# Altium schematic sheet MCU.SchDoc: Microcontroller
size A4; Engineer: CT; SheetNumber: 2; SheetTotal: 5; SPICEModelCacheWAOLYTKC: <root> / <DocumentId>WAOLYTKC</DocumentId> / </root>
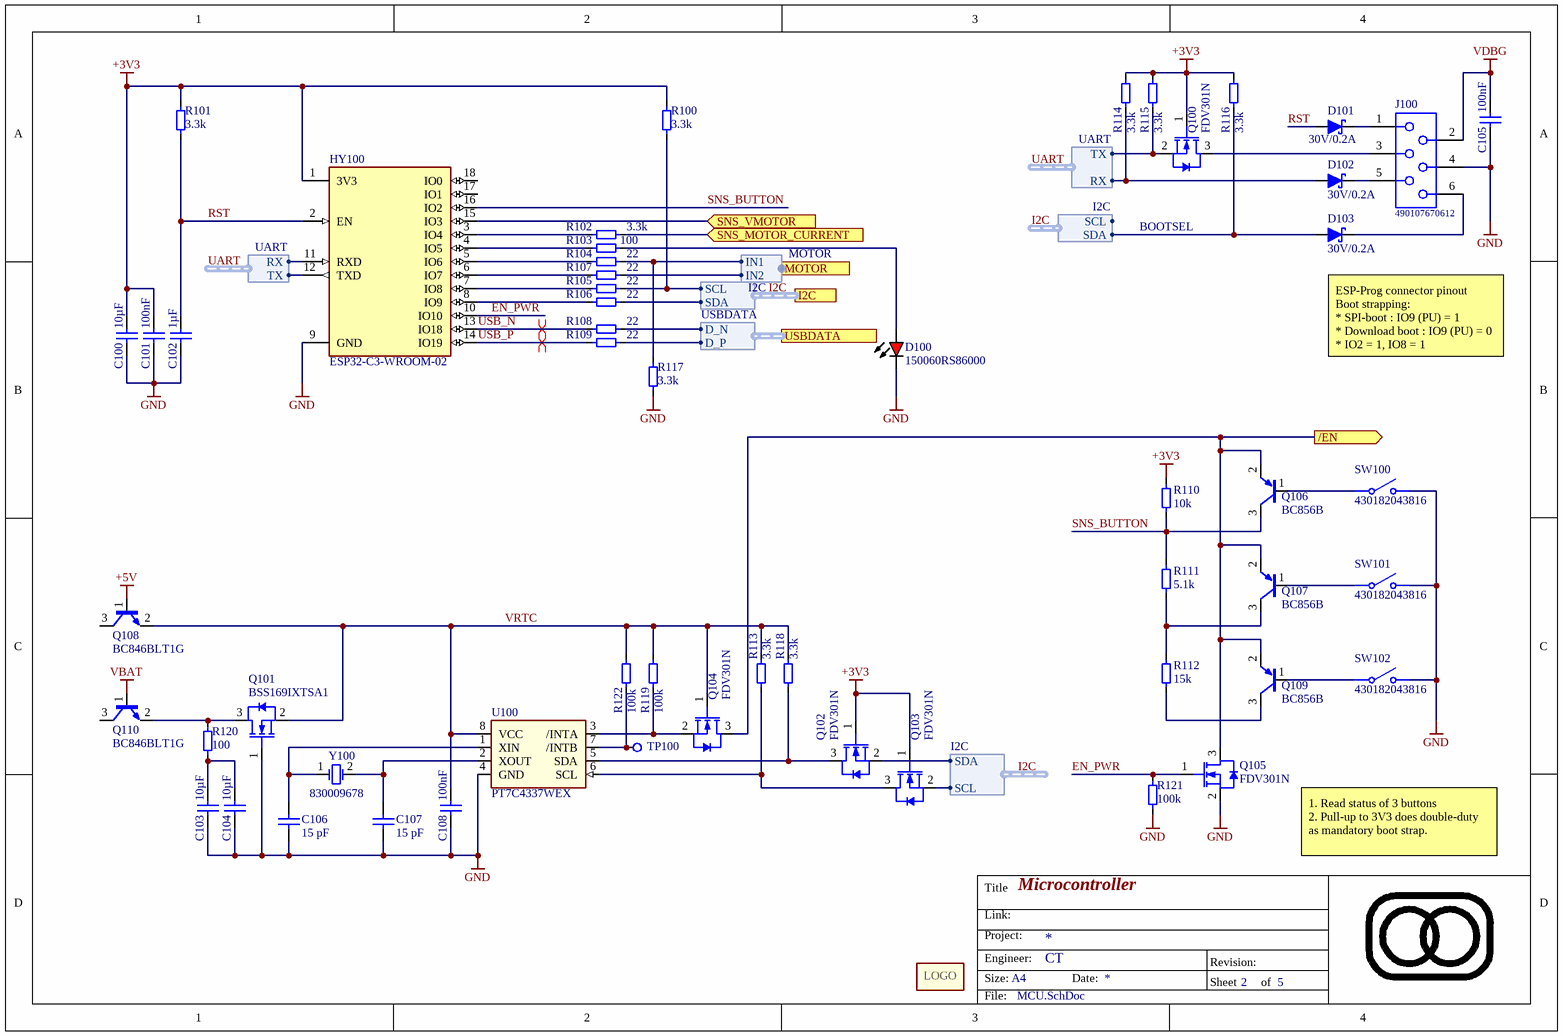
[diagram p0: MCU.SchDoc]

## Parts
C100  value 10µF  [0805-C-L]  (hidden comment: Capacitor 10µF +/-10% 10V X7R 0805)
C101  value 100nF  [0603-C-L]  (hidden comment: Capacitor 100nF +/-10% 25V X7R 0603)
C102  value 1µF  [0603-C-N]  (hidden comment: Capacitor 1µF +/-10% 16V X7R 0603)
C103  value 10µF  [0805-C-L]  (hidden comment: Capacitor 10µF +/-10% 10V X7R 0805)
C104  value 10µF  [0805-C-L]  (hidden comment: Capacitor 10µF +/-10% 10V X7R 0805)
C105  value 100nF  [0603-C-L]  (hidden comment: Capacitor 100nF +/-10% 25V X7R 0603)
C106  value 15 pF  [0603-C-N]  (hidden comment: Capacitor 15 pF +/-5% 50V C0G 0603)
C107  value 15 pF  [0603-C-N]  (hidden comment: Capacitor 15 pF +/-5% 50V C0G 0603)
C108  value 100nF  [0603-C-L]  (hidden comment: Capacitor 100nF +/-10% 25V X7R 0603)
D100  150060RS86000  [WL-SMCW_0603_150060xx8x000]
D101  value 30V/0.2A  [SOD-123-N]  (hidden comment: BAT54T1G)
D102  value 30V/0.2A  [SOD-123-N]  (hidden comment: BAT54T1G)
D103  value 30V/0.2A  [SOD-123-N]  (hidden comment: BAT54T1G)
HY100  ESP32-C3-WROOM-02  [ESP32­C3­WROOM­02]
J100  490107670612  [490107670612_Debugging Application]  (no BOM)
M100  Logo  [LOGO_9x6mm]  (value not drawn)  (no BOM)
Q100  FDV301N  [SOT-23-3-N]
Q101  BSS169IXTSA1  [SOT-23-3-N]
Q102  FDV301N  [SOT-23-3-N]
Q103  FDV301N  [SOT-23-3-N]
Q104  FDV301N  [SOT-23-3-N]
Q105  FDV301N  [SOT-23-3-N]
Q106  BC856B  [SOT-23-3-N]
Q107  BC856B  [SOT-23-3-N]
Q108  BC846BLT1G  [SOT-23-3-N]
Q109  BC856B  [SOT-23-3-N]
Q110  BC846BLT1G  [SOT-23-3-N]
R100  value 3.3k  [0603-R-N]  (hidden comment: Resistor 3.3k +/-1% 50V 0603)
R101  value 3.3k  [0603-R-N]  (hidden comment: Resistor 3.3k +/-1% 50V 0603)
R102  value 3.3k  [0603-R-N]  (hidden comment: Resistor 3.3k +/-1% 50V 0603)
R103  value 100  [0603-R-N]  (hidden comment: Resistor 100R +/-1% 50V 0603)
R104  value 22  [0603-R-N]  (hidden comment: Resistor 22R +/-1% 50V 0603)
R105  value 22  [0603-R-N]  (hidden comment: Resistor 22R +/-1% 50V 0603)
R106  value 22  [0603-R-N]  (hidden comment: Resistor 22R +/-1% 50V 0603)
R107  value 22  [0603-R-N]  (hidden comment: Resistor 22R +/-1% 50V 0603)
R108  value 22  [0603-R-N]  (hidden comment: Resistor 22R +/-1% 50V 0603)
R109  value 22  [0603-R-N]  (hidden comment: Resistor 22R +/-1% 50V 0603)
R110  value 10k  [0603-R-N]  (hidden comment: Resistor 10k +/-1% 50V 0603)
R111  value 5.1k  [0603-R-N]  (hidden comment: Resistor 5.1k +/-1% 50V 0603)
R112  value 15k  [0603-R-N]  (hidden comment: Resistor 15k +/-1% 50V 0603)
R113  value 3.3k  [0603-R-N]  (hidden comment: Resistor 3.3k +/-1% 50V 0603)
R114  value 3.3k  [0603-R-N]  (hidden comment: Resistor 3.3k +/-1% 50V 0603)
R115  value 3.3k  [0603-R-N]  (hidden comment: Resistor 3.3k +/-1% 50V 0603)
R116  value 3.3k  [0603-R-N]  (hidden comment: Resistor 3.3k +/-1% 50V 0603)
R117  value 3.3k  [0603-R-N]  (hidden comment: Resistor 3.3k +/-1% 50V 0603)
R118  value 3.3k  [0603-R-N]  (hidden comment: Resistor 3.3k +/-1% 50V 0603)
R119  value 100k  [0603-R-N]  (hidden comment: Resistor 100k +/-1% 50V 0603)
R120  value 100  [0603-R-N]  (hidden comment: Resistor 100R +/-1% 50V 0603)
R121  value 100k  [0603-R-N]  (hidden comment: Resistor 100k +/-1% 50V 0603)
R122  value 100k  [0603-R-N]  (hidden comment: Resistor 100k +/-1% 50V 0603)
SW100  430182043816  [WS-TASV_L6W6H4.3_4301x20438x6]
SW101  430182043816  [WS-TASV_L6W6H4.3_4301x20438x6]
SW102  430182043816  [WS-TASV_L6W6H4.3_4301x20438x6]
TP100  Testpad with multiple sizes  [TP_1.5mm]  (value not drawn)  (no BOM)
U100  PT7C4337WEX  [SOIC8_N]
Y100  830009678  [WE-XTAL_CFPX-217]

## Ports
/EN (out), I2C (harness I2C), MOTOR (harness MOTOR), SNS_MOTOR_CURRENT (in), SNS_VMOTOR (in), USBDATA (harness USBDATA)

## Harnesses
USBDATA: D_N, D_P
UART: RX, TX
I2C: SDA, SCL
MOTOR: IN1, IN2

## Nets
+3V3: C100.2 C101.2 HY100.1(3V3) Q100.1(G) Q102.1(G) Q103.1(G) R100.2 R101.2 R110.2 R114.2 R115.2 R116.2
+5V: Q108.1(B)
GND: C100.1 C101.1 C102.1 C103.1 C104.1 C105.1 C106.1 C107.1 C108.1 D100.1(K) HY100.9(GND) J100.4 Q101.1(G) Q105.2(S) R117.1 R121.2 SW100.2 SW101.2 SW102.2 U100.4(GND)
VBAT: Q110.1(B)
VDBG: C105.2 J100.2
/EN: Q104.3(D) Q105.3(D) Q106.2(E) Q107.2(E) Q109.2(E) ; port /EN
EN_PWR: HY100.10(IO10) Q105.1(G) R121.1
I2C.SCL: Q103.2(S) R100.1 R105.2 ; port I2C.SCL
I2C.SDA: D103.2(A) Q102.2(S) R106.2 R116.1 ; port I2C.SDA
RST: C102.2 D101.2(A) HY100.2(EN) R101.1
SNS_BUTTON: HY100.16(IO2) Q106.3(C) R110.1 R111.2
SNS_MOTOR_CURRENT: R102.2 ; port SNS_MOTOR_CURRENT
SNS_VMOTOR: HY100.15(IO3) ; port SNS_VMOTOR
UART.RX: D102.2(A) HY100.11(RXD) R114.1 ; harness UART.RX
UART.TX: HY100.12(TXD) Q100.2(S) R115.1 ; harness UART.TX
USB_N: HY100.13(IO18) R108.1
USB_P: HY100.14(IO19) R109.1
VRTC: C108.2 Q101.2(S) Q104.1(G) Q108.2(E) R113.2 R118.2 R119.1 R122.1 U100.8(VCC)
NetC103_2: C103.2 C104.2 R120.2
NetC106_2: C106.2 U100.1(XIN) Y100.1(OSC1)
NetC107_2: C107.2 U100.2(XOUT) Y100.2(OSC2)
NetD100_2: D100.2(A) R103.2
NetD101_1: D101.1(C) J100.1
NetD102_1: D102.1(C) J100.5
NetD103_1: D103.1(C) J100.6
NetHY100_3: HY100.3(IO4) R102.1
NetHY100_4: HY100.4(IO5) R103.1
NetHY100_5: HY100.5(IO6) R104.1
NetHY100_6: HY100.6(IO7) R107.1
NetHY100_7: HY100.7(IO8) R105.1
NetHY100_8: HY100.8(IO9) R106.1
NetJ100_3: J100.3 Q100.3(D)
NetQ101_3: Q101.3(D) Q110.2(E) R120.1
NetQ102_3: Q102.3(D) R118.1 U100.5(SDA)
NetQ103_3: Q103.3(D) R113.1 U100.6(SCL)
NetQ104_2: Q104.2(S) R119.2 U100.3(/INTA)
NetQ106_1: Q106.1(B) SW100.1
NetQ107_1: Q107.1(B) SW101.1
NetQ107_3: Q107.3(C) R111.1 R112.2
NetQ109_1: Q109.1(B) SW102.1
NetQ109_3: Q109.3(C) R112.1
NetR104_2: R104.2 R117.2 ; port MOTOR.IN1
NetR107_2: R107.2 ; port MOTOR.IN2
NetR108_2: R108.2 ; port USBDATA.D_N
NetR109_2: R109.2 ; port USBDATA.D_P
NetR122_2: R122.2 TP100.1(Pad) U100.7(/INTB)

Not connected (* = marked no-connect by the designer): HY100 17(IO1) 18(IO0); Q108 3(C); Q110 3(C)

## Buses and harness runs
harness I2C = port I2C

## Layout directives
differential pair: USB_N, USB_P

## Notes on the sheet
- BOOTSEL
- (near D103) ESP-Prog connector pinout
  Boot strapping:
  * SPI-boot : IO9 (PU) = 1
  * Download boot : IO9 (PU) = 0
  * IO2 = 1, IO8 = 1
- 1. Read status of 3 buttons
  2. Pull-up to 3V3 does double-duty as mandatory boot strap.
- Title
- Link:
- Size:
- Project:
- Engineer:
- A4
- Date:
- Revision:
- Sheet
- of
- File:
- (in symbol Logo) LOGO

## Library data of the parts
C100 C103 C104 = CMP-072-000663-10: WCAP-CSGP Multilayer Ceramic Chip Capacitor, General Purpose, size 0805, X7R, 10µF, 10VDC; Technical Reference: X7R0805106K010DFCT10000; Tolerance: 10%; Capacitor Type: MLCC; Insulation Resistance: 0.01GO; Length: 2mm; ComponentLink2URL: https://www.we-online.com/redexpert/spec/885012207026?ad; Packaging: Tape and Reel; ComponentLink1Description: Website Link; Design Item ID: 885012207026; Source: WCAP-CSGP.SchLib; ComponentLink2Description: Datasheet Link; Pins: 2; Usage: General Purpose; Voltage Rating: 10V; Height: 1.25mm; ComponentLink1URL: https://www.we-online.com/redexpert/article/885012207026?ad; Dielectric: X7R; Mounting Technology: SMT; Dissipation Factor: 10%; Min Operating Temperature: -55°C; Width: 1.25mm; Max Operating Temperature: 125°C; Case/Package: 0805; Match Code: WCAP-CSGP; JLCPCB Part #: C15850
C101 C105 C108 = CMP-072-000593-10: WCAP-CSGP Multilayer Ceramic Chip Capacitor, General Purpose, size 0603, X7R, 100nF, 25VDC; Capacitor Type: MLCC; Tolerance: 10%; Dissipation Factor: 3.5%; Technical Reference: X7R0603104K025DFCT20000; Insulation Resistance: 5GO; Length: 1.6mm; Dielectric: X7R; Height: 0.8mm; Pins: 2; Min Operating Temperature: -55°C; Usage: General Purpose; Mounting Technology: SMT; Case/Package: 0603; Width: 0.8mm; Max Operating Temperature: 125°C; Voltage Rating: 25V; Design Item ID: 885012206071R; ComponentLink1URL: https://www.we-online.com/redexpert/article/885012206071R?ad; ComponentLink2URL: https://www.we-online.com/redexpert/spec/885012206071R?ad; Packaging: Tape and Reel; ComponentLink1Description: Website Link; Match Code: WCAP-CSGP; ComponentLink2Description: Datasheet Link; Source: WCAP-CSGP.SchLib
C102 = CMP-001-00004-18: Capacitor MLCC, General Purpose, size 0603, X7R, 1µF, +/-10%, 16V; Tolerance: 10%; Usage: General Purpose; Mounting Technology: SMT; Width: 0.8mm; Voltage Rating: 16V; RoHS Compliant: True; Capacitor Type: MLCC; Case/Package: 0603; Min Operating Temperature: -55°C; Dielectric: X7R; Pins: 2; Max Operating Temperature: 125°C; Length: 1.6mm; Height: 0.8mm; JLCPCB Part #: C15849
C106 C107 = CMP-001-00107-9: Capacitor MLCC, General Purpose, size 0603, C0G, 15 pF, +/-5%, 50V; Tolerance: 5%; Min Operating Temperature: -55°C; RoHS Compliant: Yes; Dielectric: C0G; Width: 0.8mm; Voltage Rating: 50V; Pins: 2; Height: 0.8mm; Max Operating Temperature: 125°C; Usage: General Purpose; Case/Package: 0603; Mounting Technology: SMT; Capacitor Type: MLCC; Length: 1.6mm
D100 = CMP-002-001080-4: WL-SMCW Mono-color Chip LED Waterclear, size 0603, Red, 2V, 60°; Manufacturer: Wurth Elektronik; Chip Technology: AlInGaP; Case/Size Code: 0603; Luminous Intensity: 800mcd; Dominant Wavelength: 624nm; Peak Wavelength: 632nm; Forward Voltage: 2V; ComponentLink2URL: https://www.we-online.com/redexpert/spec/150060RS86000?ad; Operating Temperature Min: -40°C; ComponentLink1URL: https://www.we-online.com/redexpert/article/150060RS86000?ad; Viewing Angle: 60°; Operating Temperature Max: 85°C; Manufacturer Part Number: 150060RS86000; Packaging: Tape and Reel; ComponentLink2Description: Datasheet Link; Design Item ID: 150060RS86000; Width: 0.8mm; Emitting Color: Red; Length: 1.6mm; Pin Count: 2; Match Code: WL-SMCW; Source: WL-SMCW.SchLib; Height: 0.95mm; Component Type: Standard; Category: Signal LEDs; ComponentLink1Description: Website Link; Mount: Surface Mount
D101-D103 = CMP-004-00035-8: Diode Schottky 30V 200mA (DC) Surface Mount SOD-123; Manufacturer: onsemi; Ir - Reverse Current: 2 uA; Ifsm - Forward Surge Current: 600 mA; Vf - Forward Voltage: 800 mV; Forward Voltage: 800mV; Forward Current If: 200 mA; Reverse Voltage Vr: 30 V; Case/Package: SOD-123; Datasheet: https://www.onsemi.com/products/discrete-power-modules/schottky-diodes-schottky-rectifiers/bat54t; Operating Temperature: -55C to 125C; JLCPCB Part #: C8598; Max Reverse Voltage (DC): 30V; Forward Current: 200mA
HY100 = CMP-019-000004-8: Module with 4 MB flash and on­board PCB antenna / Built around RISC­V single­core SoC / Supporting 2.4 GHz Wi­Fi and Bluetooth 5; pin to pad: 9>0+9; Design Item ID: ESP32-C3-WROOM-02; Source: 7c7_Modules.SchLib; Component Type: Standard; Pin Count: 19
J100 = CMP-002-000028-7: WR-WST REDFIT IDC SKEDD, pitch 2.54mm, 6pins; Contact Resistance max.: 10mOhm; Gender: Transition; Rated Current: 1A; Pin Number: 6; Working Voltage: 100V(AC); Connector Type: Cable,IDC; Design Item ID: 490107670612; Source: WR-WST.SchLib; Packaging: Tube; ComponentLink2Description: Datasheet; Part Number: 490107670612; ComponentLink1Description: Manufacturer; Operating Temperature: -25 to +105degC; Pitch: 2.54mm; ComponentLink1URL: http://www.we-online.de; Published Date: November 2019; Mounting Technology: Press-In; Publisher: Wurth Elektronik; ComponentLink2URL: https://katalog.we-online.com/em/datasheet/490107670612.pdf; RoHS Compliant: Yes; Contact Plating: Gold; Series: REDFIT WR-WST
Q100 Q102-Q105 = CMP-013-00055-7: Transistor MOSFET N-Ch. 25V 220mA 0, 35W 4Ohm SOT23; Number of Channels: 1; Rise Time: 6ns; Rds On Max: 4R; Vgs (Max): 8V; Max Power Dissipation: 350mW; Input Capacitance: 9.5pF; Polarity: N-CHANNEL; Drain to Source Resistance: 5R; Vgs(th) (Max) @ Id: 1.06V @250µA; Transistor Type: NMOS; Turn-Off Delay Time: 3.5ns; Turn-On Delay Time: 3.2ns; Packaging: Tape and Reel; Series: -; Length: 2.9mm; Weight: 0.001093oz; Continuous Drain Current (ID): 220mA; Width: 1.3mm; Vds Max: 25V; Height: 1.2mm; Mounting Technology: Surface Mount; Gate to Source Voltage (Vgs): 8V; Min Operating Temperature: -55°C; Case/Package: SOT-23-3; Fall Time: 6ns; Id - Continuous Drain Current: 220mA; Pins: 3; Drain to Source Voltage (Vdss): 25V; Max Operating Temperature: 150°C; Package Quantity: 3000; JLCPCB Part #: C15310
Q101 = CMP-013-00057-5: Mosfet, N-Ch, 100V, 0.19A, Sot-23 Rohs Compliant: Yes; Transistor Type: NMOS; Rds On Max: 2.9Ohm; Power: 360mW; Vgs(th) (Max) @ Id: -1.8V @ 50µA; Id - Continuous Drain Current: 190mA; Vds Max: 100V; Case/Package: SOT-23-3
Q106 Q107 Q109 = CMP-013-00059-2: Bipolar Transistor, SOT-23, 65V, 100mA, PNP; Power Dissipation: 250mW; Pins: 3; Case/Package: SOT-23; Voltage: 65V; Polarity: PNP; Current: 100mA
Q108 Q110 = CMP-013-00048-9: NPN Ic=100mA Vceo=65V hfe=200~450 P=225mW SOT-23; Ic Max: 100mA; Vce Max: 65V; Case/Package: SOT-23-3; Transistor Type: NPN
R100-R102 R113-R118 = CMP-009-00243-10: Chip Resistor, Thick Film, General Purpose, 0603, 100mW, 50V, 3.3 kOhm, +/-1%; Tolerance: 1%; Elements: 1; Resistor Type: Thick Film; RoHS Compliant: Yes; Voltage Rating: 50V; Usage: General Purpose; Case/Package: 0603; Pins: 2; Power Rating: 100mW; Mounting Technology: SMT; Min Operating Temperature: -55°C; JLCPCB Part #: C22978; Max Operating Temperature: 155°C
R103 R120 = CMP-009-00232-10: Chip Resistor, Thick Film, General Purpose, 0603, 63mW, 50V, 100 Ohm, +/-1%; Tolerance: 1%; Elements: 1; Temperature Coefficient: 100ppm/°C; Voltage Rating: 50V; Mounting Technology: SMT; Max Operating Temperature: 155°C; Min Operating Temperature: -55°C; Usage: General Purpose; Case/Package: 0603; Pins: 2; JLCPCB Part #: C22775; RoHS Compliant: Yes; Power Rating: 63mW; Resistor Type: Thick Film
R104-R109 = CMP-009-00027-19: Chip Resistor, Thick Film, General Purpose, 0603, 100mW, 50V, 22 Ohm, +/-1%; Tolerance: 1%; Elements: 1; Min Operating Temperature: -55°C; Pins: 2; Case/Package: 0603; Usage: General Purpose; Voltage Rating: 50V; Power Rating: 100mW; Mounting Technology: SMT; Resistor Type: Thick Film; Max Operating Temperature: 155°C; RoHS Compliant: True; JLCPCB Part #: C23345
R110 = CMP-009-00017-19: Chip Resistor, Thick Film, General Purpose, 0603, 100mW, 50V, 10 kOhm, +/-1%; Tolerance: 1%; Elements: 1; Resistor Type: Thick Film; RoHS Compliant: True; Voltage Rating: 50V; Usage: General Purpose; Case/Package: 0603; Pins: 2; Power Rating: 100mW; Mounting Technology: SMT; Min Operating Temperature: -55°C; JLCPCB Part #: C25804; Max Operating Temperature: 155°C
R111 = CMP-009-00192-13: Chip Resistor, Thick Film, General Purpose, 0603, 100mW, 50V, 5.1 kOhm, +/-1%; Tolerance: 1%; Elements: 1; Temperature Coefficient: 100ppm/°C; Resistor Type: Thick Film; Voltage Rating: 50V; Usage: General Purpose; Case/Package: 0603; Pins: 2; Power Rating: 100mW; Mounting Technology: SMT; Min Operating Temperature: -55°C; JLCPCB Part #: C144594; Max Operating Temperature: 155°C; REACH SVHC: No SVHC
R112 = CMP-009-00303-2: Chip Resistor, Thick Film, General Purpose, 0603, 100mW, 50V, 15 kOhm, +/-1%; Tolerance: 1%; Elements: 1; Resistor Type: Thick Film; RoHS Compliant: True; Voltage Rating: 50V; Usage: General Purpose; Case/Package: 0603; Pins: 2; Power Rating: 100mW; Mounting Technology: SMT; Min Operating Temperature: -55°C; Max Operating Temperature: 155°C
R119 R121 R122 = CMP-009-00023-20: Chip Resistor, Thick Film, General Purpose, 0603, 100mW, 50V, 100 kOhm, +/-1%; Elements: 1; Tolerance: 1%; JLCPCB Part #: C25803; Min Operating Temperature: -55°C; Usage: General Purpose; Resistor Type: Thick Film; Pins: 2; Mounting Technology: SMT; Case/Package: 0603; Max Operating Temperature: 155°C; RoHS Compliant: True; Voltage Rating: 50V; Power Rating: 100mW
SW100-SW102 = CMP-002-000142-4: WS-TASV SMT Tact Switch, 12VDC, 50mA, 160g, height 4.3mm; pin to pad: 1>A1+A2 2>B1+B2; Manufacturer: Wurth Elektronik; Electrical Life: 1000000Cycles; Actuator Color: Black; Rated Voltage: 12V; Washable: No; Length: 6mm; Terminal Plating: Silver; ComponentLink2Description: Datasheet; Packaging: Tape and Reel; Terminal Material: Copper Alloy; ComponentLink2URL: https://www.we-online.com/catalog/datasheet/430182043816.pdf; Operating Temperature min.: -40C; Source: WS-TASV.SchLib; Operating Temperature max.: 85C; Mounting Technology: SMT; Contact Plating: Silver; Contact Material: Stainless Steel; Operation Force: 160g; ComponentLink1Description: Manufacturer Link; Manufacturer Part Number: 430182043816; Rated Current: 50mA; Pin Count: 4; Design Item ID: 430182043816; ComponentLink1URL: http://www.we-online.de; Width: 6mm; Height: 4.3mm; Component Type: Standard
TP100 = CMP-027-000000-13: Testpad land; Pin Count: 1; Component Type: Standard; Source: 7c7_Connectors.SchLib; Design Item ID: Testpad
U100 = CMP-023-00005-2: Real Time Clock Serial Clock/Calendar/Alarm/Interrupt/Square-Wave Output 8-Pin SOIC T/R; Interface: I2C,Serial,2-Wire; Date Format: YY-MM-DD-dd; Time Format: HH:MM:SS (12/24 hr); Case/Package: SOIC; Min Operating Temperature: -40°C; Max Operating Temperature: 85°C; Packaging: Cut Tape; Pins: 8; Mounting Technology: Surface Mount; Package Quantity: 1; RoHS Compliant: Yes
Y100 = CMP-030-000070-2: WE-XTAL Watch Crystal, SMT, CFPX-217, 32.768kHz, +/-20ppm; Manufacturer: Wurth Elektronik; Load Capacitance: 12.5pF; Manufacturer Part Number: 830009678; ComponentLink1Description: Manufacturer; Size: CFPX-217; Mounting Technology: SMT; Packaging: Tape and Reel; ComponentLink2URL: https://katalog.we-online.com/pbs/datasheet/830009678.pdf; Frequency Tolerance: +/-20ppm; Operating Temperature: -40 to +85degC; Component Type: Standard; Frequency Stability: -; Design Item ID: 830009678; Frequency: 32.768kHz; Pin Count: 2; ComponentLink1URL: http://www.we-online.de; Published Date: July 2020; Source: WE-XTAL_CFPX-217.SchLib; ComponentLink2Description: Datasheet